# Altium schematic sheet simulation.SchDoc
size A; SheetNumber: 3; SheetTotal: 3
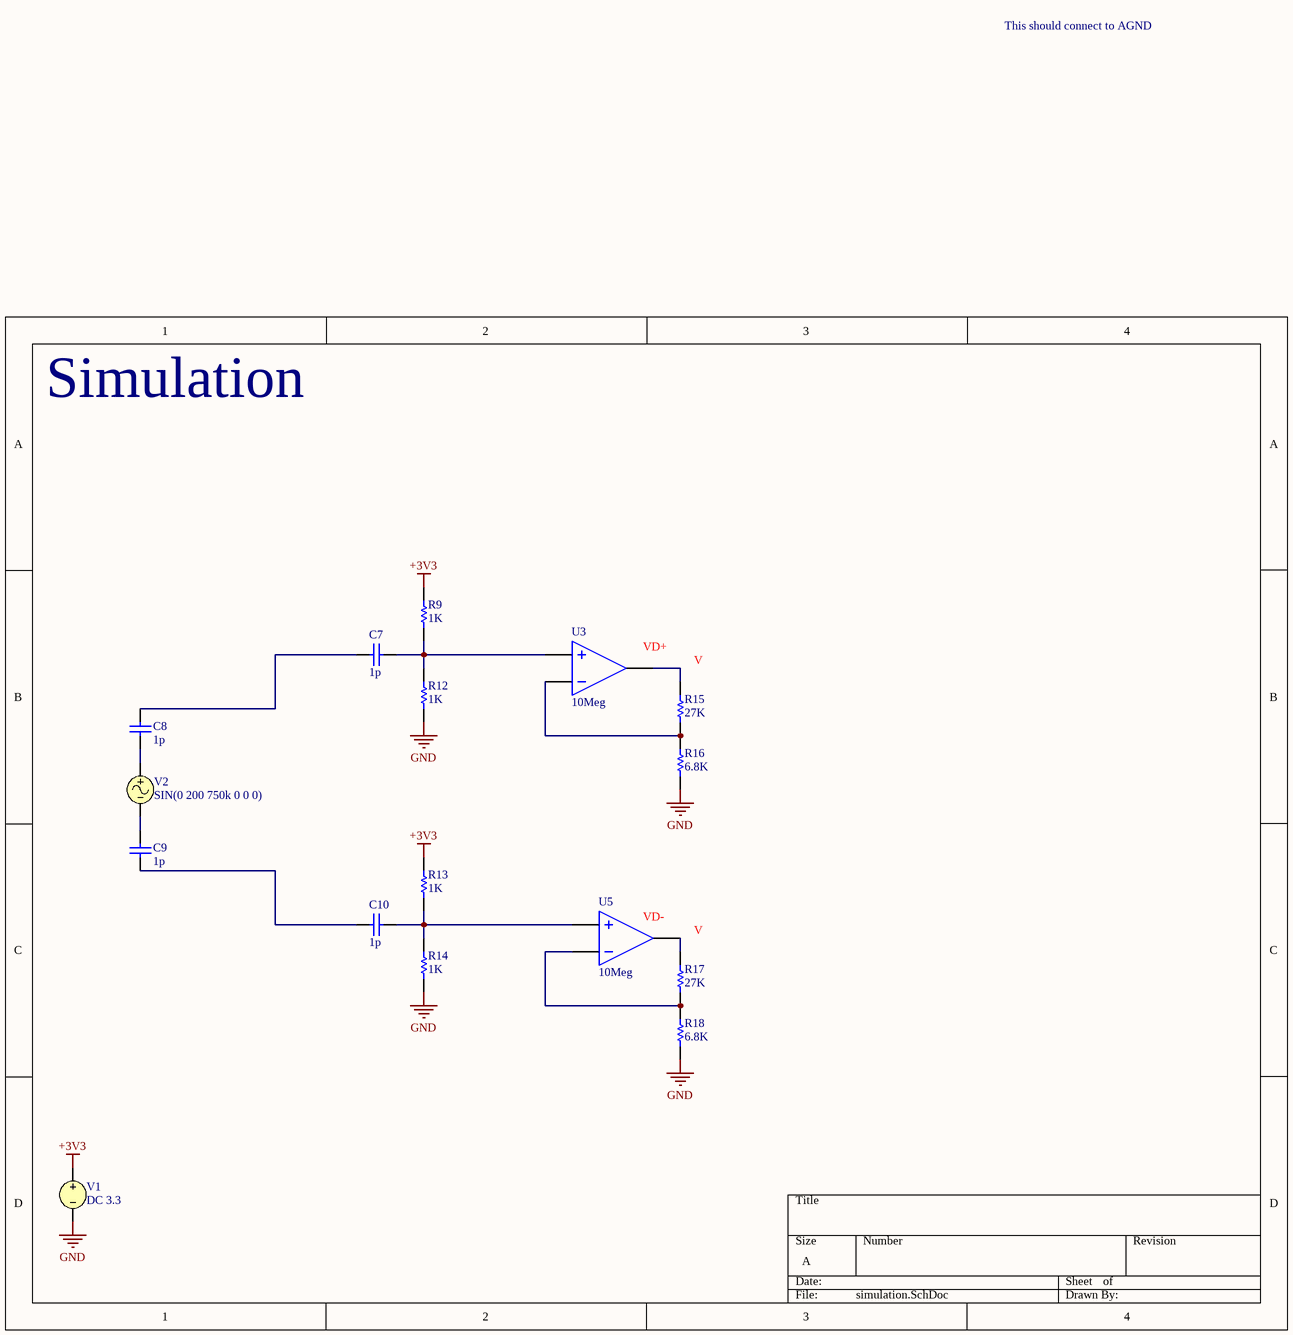
[diagram p0: simulation.SchDoc]

## Parts
C7  value 1p  (hidden comment: Capacitor)
C8  value 1p  (hidden comment: Capacitor)
C9  value 1p  (hidden comment: Capacitor)
C10  value 1p  (hidden comment: Capacitor)
R9  value 1K  (hidden comment: Resistor)
R12  value 1K  (hidden comment: Resistor)
R13  value 1K  (hidden comment: Resistor)
R14  value 1K  (hidden comment: Resistor)
R15  value 27K  (hidden comment: Resistor)
R16  value 6.8K  (hidden comment: Resistor)
R17  value 27K  (hidden comment: Resistor)
R18  value 6.8K  (hidden comment: Resistor)
U3  GAIN: 10Meg  (hidden comment: Ideal Operational Amplifier)
U5  GAIN: 10Meg  (hidden comment: Ideal Operational Amplifier)
V1  DC 3.3
V2  SIN(0 200 750k 0 0 0)

## Nets
+3V3: R9.2 R13.2 V1.1
GND: R12.1 R14.1 R16.1 R18.1 V1.2
NetC7_1: C7.1 C8.2
NetC7_2: C7.2 R9.1 R12.2 U3.2(IN+)
NetC8_1: C8.1 V2.1
NetC9_1: C9.1 C10.1
NetC9_2: C9.2 V2.2
NetC10_2: C10.2 R13.1 R14.2 U5.2(IN+)
NetR15_1: R15.1 R16.2 U3.1(IN-)
NetR15_2: R15.2 U3.3(OUT)
NetR17_1: R17.1 R18.2 U5.1(IN-)
NetR17_2: R17.2 U5.3(OUT)

## Notes on the sheet
- This should connect to AGND
- Simulation

## Library data of the parts
C7-C10 = Capacitor: SimulationGenericComponent: True
R9 R12-R18 = Resistor: TC1: 0; SimulationGenericComponent: True; TC2: 0
U3 U5 = OpAmp: SimulationGenericComponent: True
V1 = VSRC: Voltage Source; Note: PCB Footprint - Not required; AC Magnitude: 1; AC Phase: 0; Value: 3.3; Published: 8-Jun-2000; LatestRevisionDate: 17-Jul-2002; LatestRevisionNote: Re-released for DXP Platform.; PackageReference: Not Applicable; Publisher: Altium Limited
V2 = VSIN: Sinusoidal Voltage Source; Note: PCB Footprint - Not required; Offset: 0; Amplitude: 200; AC Magnitude: 1; Published: 8-Jun-2000; LatestRevisionDate: 15-Nov-2004; LatestRevisionNote: Corrected Netlist.; PackageReference: Not Applicable; Publisher: Altium Limited; Frequency: 750k; Delay: 0; Damping Factor: 0; Phase: 0; DC Magnitude: 0; AC Phase: 0